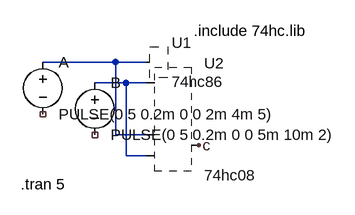
[diagram p0: schematic Draft6.asc]
Draft6.asc, the LTspice schematic file:
Version 4
SHEET 1 880 680
WIRE 80 0 -32 0
WIRE 128 0 80 0
WIRE 96 32 48 32
WIRE 128 32 96 32
WIRE 80 112 80 0
WIRE 128 112 80 112
WIRE 96 144 96 32
WIRE 128 144 96 144
FLAG 208 128 c
SYMBOL 74HC\\74hc86 176 -48 R0
SYMATTR InstName U1
SYMBOL 74HC\\74hc08 176 64 R0
SYMATTR InstName U2
SYMBOL voltage -32 -16 R0
WINDOW 123 0 0 Left 0
WINDOW 39 0 0 Left 0
SYMATTR InstName A
SYMATTR Value PULSE(0 5 0.2m 0 0 2m 4m 5)
SYMBOL voltage 48 16 R0
WINDOW 123 0 0 Left 0
WINDOW 39 0 0 Left 0
SYMATTR InstName B
SYMATTR Value PULSE(0 5 0.2m 0 0 5m 10m 2)
TEXT 200 -48 Left 2 !.include 74hc.lib
TEXT -66 188 Left 2 !.tran 5

The netlist it stands for:
* Draft6.asc
* U1: 74hc86 (symbol 74HC\74hc86 not available, pin order unknown); nets seen at it: N001
* U2: 74hc08 (symbol 74HC\74hc08 not available, pin order unknown); nets seen at it: c, N001, N002
V§A N001 NC_01 PULSE(0 5 0.2m 0 0 2m 4m 5)
V§B N002 NC_02 PULSE(0 5 0.2m 0 0 5m 10m 2)
.include 74hc.lib
.tran 5
.backanno
.end